# EAGLE design senseBox-RTC-RV8523_v20 (EAGLE 7.7.0)
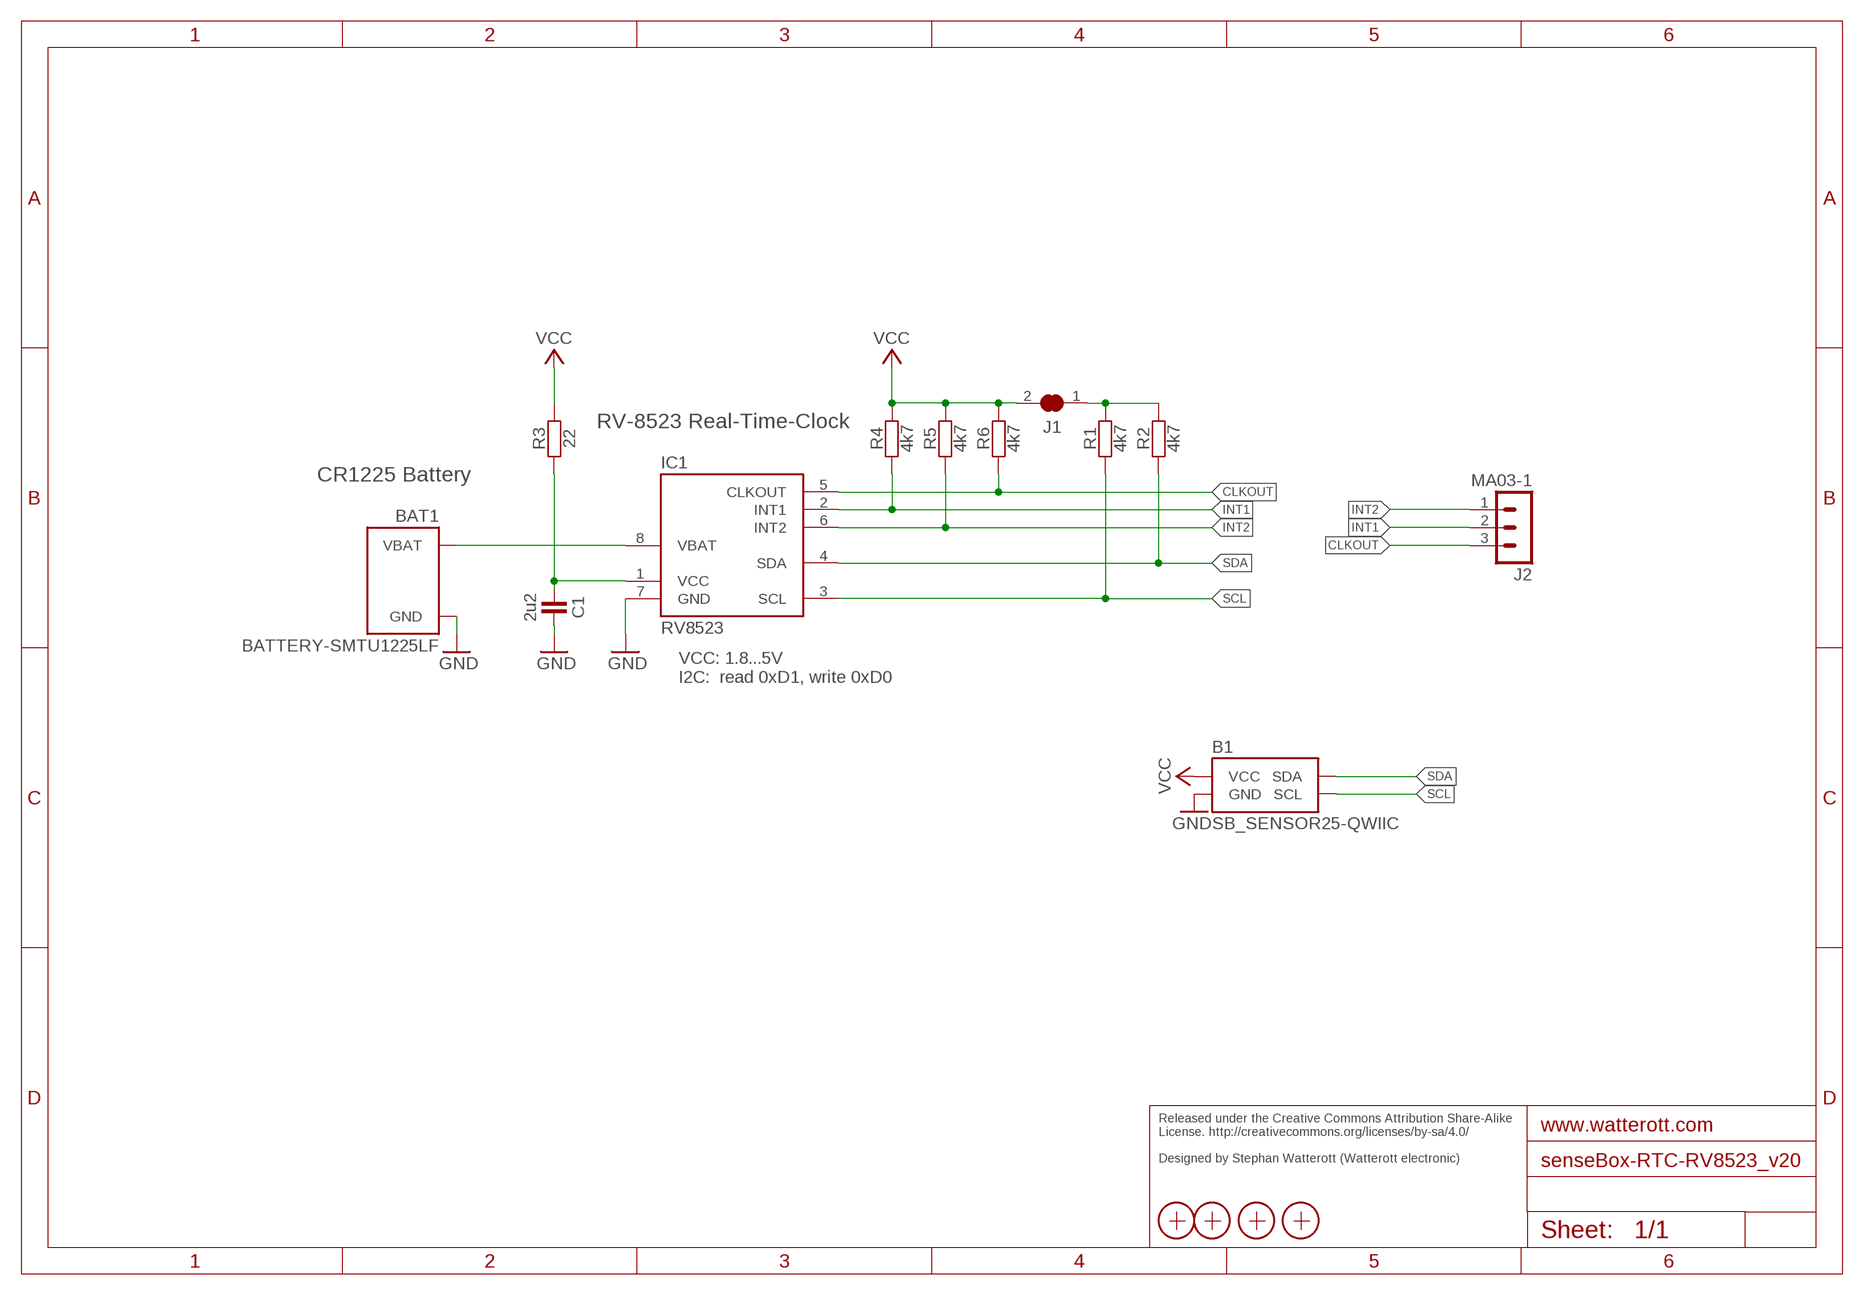
[diagram p0: schematic, sheet 1]

## Parts
B1  SB_SENSOR25-QWIIC  [SB-25X25_QWIIC]
BAT1  BATTERY-SMTU1225LF  [BAT-SMTU1225LF]
C1  2u2  CAPACITOR-C0402  [R0402]
IC1  RV8523  RV8523-C3  [RTC-C3]
J1  JUMPER2  [JUMPER2]
J2  MA03-1  [MA03-1]
R1  4k7  RESISTOR-R0402  [R0402]
R2  4k7  RESISTOR-R0402  [R0402]
R3  22  RESISTOR-R0402  [R0402]
R4  4k7  RESISTOR-R0402  [R0402]
R5  4k7  RESISTOR-R0402  [R0402]
R6  4k7  RESISTOR-R0402  [R0402]
X1  PASSER-07  [PASSER_07MM]
X2  PASSER-07  [PASSER_07MM]
X3  PASSER-07  [PASSER_07MM]
X4  PASSER-07  [PASSER_07MM]

## Nets
CLKOUT: IC1.5(CLKOUT) J2.3 R6.1
GND: B1.GND B1.GND1(GND) B1.GND2(GND) B1.SHLD1(GND) B1.SHLD2(GND) B1.SHLD3(GND) B1.SHLD4(GND) B1.SHLD5(GND) B1.SHLD6(GND) BAT1.-(GND) C1.2 IC1.7(GND)
I2C_VCC: J1.1 R1.2 R2.2
INT1: IC1.2(INT1) J2.2 R4.1
INT2: IC1.6(INT2) J2.1 R5.1
RV_VCC: C1.1 IC1.1(VCC) R3.1
SCL: B1.SCL B1.SCL1(SCL) B1.SCL2(SCL) IC1.3(SCL) R1.1
SDA: B1.SDA B1.SDA1(SDA) B1.SDA2(SDA) IC1.4(SDA) R2.1
VBAT: BAT1.+(VBAT) IC1.8(VBAT)
VCC: B1.VCC B1.VCC1(VCC) B1.VCC2(VCC) J1.2 R3.2 R4.2 R5.2 R6.2

## Notes on the sheet
- RV-8523 Real-Time-Clock
- CR1225 Battery
- VCC: 1.8...5V
  I2C:  read 0xD1, write 0xD0
- Released under the Creative Commons Attribution Share-Alike 
  License. http://creativecommons.org/licenses/by-sa/4.0/
  
  Designed by Stephan Watterott (Watterott electronic)

## Library data of the parts
B1 = we-board:SB_SENSOR: SenseBox Sensors/Breakouts
BAT1 = we-power:BATTERY: Battery Holder
C1 = we-rcl:CAPACITOR: Capacitors ...2.2uF -> 0603 ...4.7uF -> 0805 ...10uF -> 1206
IC1 = we-chip:RV8523: Micro Crystal RV-8323 RTC (Real Time Clock)
J1 = we-rcl:JUMPER2: 2 Pin Jumpers
J2 = we-con:MA03-1: Pin Header
R1-R6 = we-rcl:RESISTOR: Resistors all kinds in 0603
X1-X4 = we-symbol:PASSER: Fiducial Markers

## Board
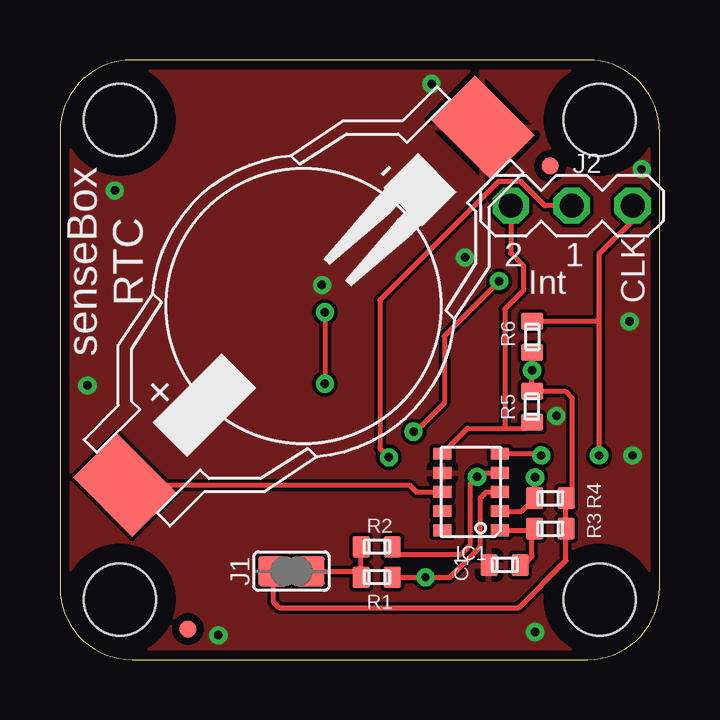
[diagram p1: board, top side]
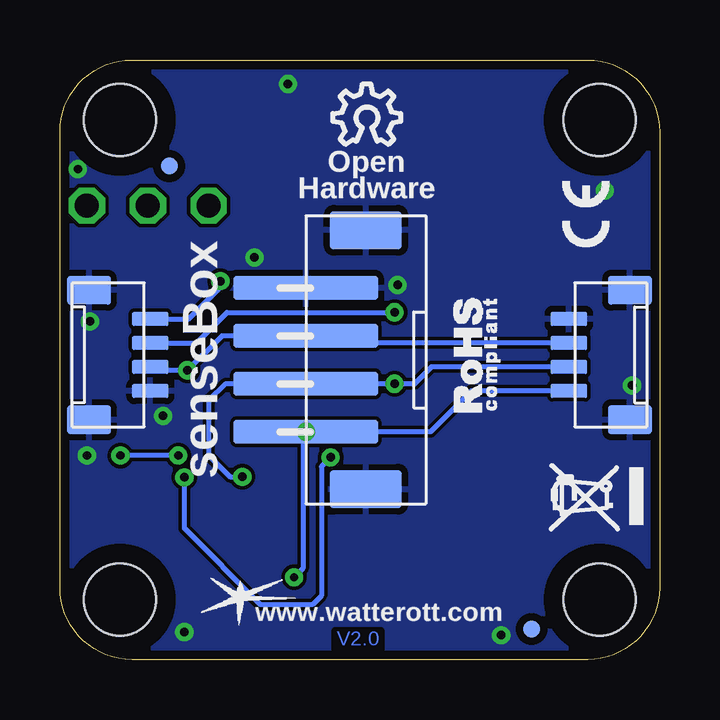
[diagram p2: board, bottom side, seen from below]

Size 25 x 25 mm. Coordinates in mm from the lower left corner, seen from the top.
Copper layers (1*16): Top 0.035mm / dielectric 1.5mm / Bottom 0.035mm
Design rules "default *": minimum track width 6mil, minimum drill 0.3mm, track to track 6mil, track to pad 6mil, pad to pad 6mil, via to via 6mil, smd to smd 1mil, copper to edge 15mil, drill to drill 8mil, minimum pad ring 10mil, minimum via ring 8mil, stop-mask expansion 4mil, vias tented up to drill 0.7mm, thermal gap 10mil

### Footprints (pad centres in the part's own frame; a part is rotated, then mirrored left to right if it is on the bottom)
SB-25X25_QWIIC = smd 1.5 x 0.6 bottom: GND 3.782,14.2; GND2 21.237,11.2; SCL 3.782,11.2; SCL2 21.237,14.2; SDA 3.782,12.2; SDA2 21.237,13.2; VCC 3.782,13.2; VCC2 21.237,12.2 | smd 6 x 1 bottom: GND1 14.746,15.5; SCL1 14.746,9.5; SDA1 14.746,11.5; VCC1 14.746,13.5 | smd 1.8 x 1.2 bottom: SHLD1 1.232,15.4; SHLD2 1.232,10; SHLD5 23.787,10; SHLD6 23.787,15.4 | smd 3 x 1.6 bottom: SHLD3 12.246,17.9; SHLD4 12.246,7.1 | hole 3: 2.5,22.5; 2.5,2.5; 22.5,22.5; 22.5,2.5
BAT-SMTU1225LF = smd 3.5 x 2.6: + 0,10.55; - 0,-10.55
R0402 = smd 0.9 x 0.7: 1 0,0.65; 2 0,-0.65
RTC-C3 = smd 0.8 x 0.5: 1 -1.2,1.6; 2 -1.2,0.8; 3 -1.2,0; 4 -1.2,-0.8; 5 -1.2,-1.6; 6 1.2,-1.6; 7 1.2,-0.8; 8 1.2,0; 9 1.2,0.8; 10 1.2,1.6
JUMPER2 = smd 1.25 x 1.25: 1 0,0.76; 2 0,-0.76
MA03-1 = drill 1 octagon: 1 0,2.54; 2 0,0; 3 0,-2.54
PASSER_07MM = smd 0.7 x 0.7: X 0,0

### Placement (x,y rotation side)
B1  0,0 0 top
BAT1  10.16,14.73 135 top
C1  18.54,3.94 270 top
IC1  17.14,6.99 180 top
J1  9.65,3.68 270 top
J2  21.34,18.92 90 top
R1  13.21,3.43 270 top
R2  13.21,4.7 270 top
R3  20.45,5.46 90 top
R4  20.45,6.73 90 top
R5  19.68,10.54 180 top
R6  19.68,13.46 0 top
X1  20.45,20.57 0 top
X2  5.33,1.27 0 top
X3  5.33,1.27 0 bottom
X4  20.45,20.57 0 bottom

### Tracks (layer width: path | path; a pad name or v marks a point on that pad's centre or on a via)
CLKOUT  (via drill 0.35)
  Top 0.2: J2.3 23.88,18.3 22.47,16.9 22.47,14.22 | IC1.5 19.99,8.59 v20.07,8.51 | 22.47,14.22 v22.47,8.52 v22.48,8.51 | R6.1 22.36,14.11 22.47,14.22
  Bottom 0.2: v20.07,8.51 v22.48,8.51
GND  (via drill 0.35)
  other vias: 2.29,19.56 15.49,24 24.26,20.45 19.81,1.14 6.6,1.02 23.88,8.51 20.7,10.16 1.14,11.43 23.75,14.1 10.92,15.62 16.89,16.76
  pour Top: 0,25 25,25 25,0 0,0
  pour Bottom: 0,25 25,25 25,0 0,0
I2C_VCC
  Top 0.2: J1.1 12.3,3.68 R1.2 R2.2
INT1  (via drill 0.35)
  Top 0.2: IC1.2 19.25,6.18 R4.1 | R4.1 19.81,6.75 19.81,7.49 | R4.1 19.8,7.58 v19.81,7.6 | J2.2 20.22,18.92 19.21,19.93 18.28,19.93 13.34,14.99 13.34,8.81 v13.72,8.43 13.72,8.38
  Bottom 0.2: v13.72,8.43 14.1,8.04 14.1,2.66 14.47,2.29 16.64,2.29 19.81,5.46 v19.81,7.6
INT2
  Top 0.2: 18.54,9.64 17,9.64 IC1.6 | J2.1 18.8,16.95 19.33,16.42 19.33,15.39 18.54,14.61 18.54,9.64 | R5.1 19.43,9.64 18.54,9.64
RV_VCC
  Top 0.2: IC1.1 19.68,5.38 | 19.68,5.38 19.72,5.38 R3.1 | C1.1 19.32,3.94 19.68,4.3 19.68,5.38
SCL  (via drill 0.35)
  Top 0.2: R1.1 v15.24,3.43 16.26,3.43 17.53,4.7 17.53,6.73 17.78,6.99 IC1.3 | v18.31,15.77 16.03,13.49 16.03,10.69 14.73,9.4 14.73,9.49 B1.SCL1
  Bottom 0.2: B1.SCL 7.85,11.2 9.55,9.5 B1.SCL1 14.87,9.37 14.87,3.8 v15.24,3.43 | B1.SCL2 19.64,14.2 18.31,15.52 v18.31,15.77
  other vias: 14.75,9.5
SDA  (via drill 0.35)
  Top 0.2: R2.1 14.18,4.38 16.69,4.38 17.11,4.79 17.11,7.33 v17.4,7.62 17.56,7.79 IC1.4 | v11.05,14.48 v11.05,11.5
  Bottom 0.2: B1.SDA 9.52,12.2 10.22,11.5 v11.05,11.5 B1.SDA1 18.09,11.5 18.8,10.79 18.8,8.51 17.91,7.62 v17.4,7.62 | B1.SDA2 19.31,13.2 18.03,14.48 v11.05,14.48
VBAT
  Top 0.2: BAT1.+ 14.57,7.27 14.86,6.99 IC1.8
VCC  (via drill 0.35)
  Top 0.2: R6.2 v19.68,12.06 R5.2 21.07,11.19 21.35,10.91 21.35,6.99 R4.2 R3.2 21.1,4.13 19.13,2.16 9.14,2.16 8.89,2.41 J1.2
  Bottom 0.2: B1.VCC 13.71,13.2 14.01,13.5 B1.VCC1 18.25,13.5 v19.68,12.06 21.1,12.06 B1.VCC2

### Text on the board
Bottom: V2.0
tPlace: senseBox / RTC | 2 | 1 | Int | CLK
Reference: Silkscreen: 21 bPlace + 22 bPlace